# Altium schematic sheet Driver_SCR.SchDoc
size 93 x 63 mm; PageSetup: Record=PageOptions|CenterHorizontal=True|CenterVertical=True|PrintScale=0.71|XCorrection=1.00|YCorrection=1.00|PrintKind=1|BorderSize=5000000|LeftOffset=0|BottomOffset=0|Orientation=2|PaperLength=1000|PaperWidth=1000|Scale=100|PaperSource=15|PrintQuality=4000|MediaType=1|DitherType=10|PrintScaleMode=1|PaperKind=A4|PaperIndex=9
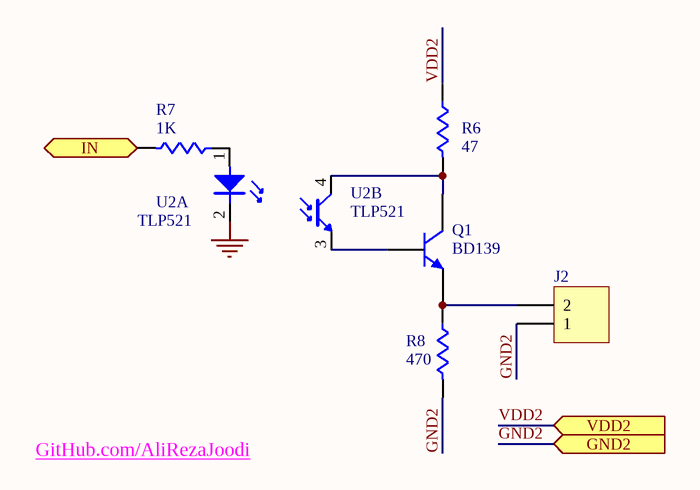
[diagram p0: Driver_SCR.SchDoc]

## Parts
J2  J2  [Fonics_2PIN_1]  (value not drawn)
Q1  Q1  value BD139  [SOT-32]
R6  value 47  [AXIAL-0.4]  (hidden comment: R6)
R7  value 1K  [AXIAL-0.4]  (hidden comment: R7)
R8  value 470  [AXIAL-0.4]  (hidden comment: R8)
U2  value TLP521  [DIP-4]  (hidden comment: U2)  (parts A,B of 2)

## Ports
GND2 (in), IN (in), VDD2 (in)

## Nets
GND: U2.2(K)
GND2: J2.1 R8.2 ; port GND2
IN: R7.2 ; port IN
VDD2: R6.1 ; port VDD2
NetJ2_2: J2.2 Q1.E R8.1
NetQ1_B: Q1.B U2.3(E)
NetQ1_C: Q1.C R6.2 U2.4(C)
NetR7_1: R7.1 U2.1(A)

## Notes on the sheet
- GitHub.com/AliRezaJoodi

## Library data of the parts
J2 = Header 2: Header, 2-Pin; LatestRevisionDate: 17-Jul-2002; LatestRevisionNote: Re-released for DXP Platform.; Publisher: Altium Limited
Q1 = BD139: NPN Transistor; E-mail: picpars@gmail.com; De: Seyed Mohsen Ghasemian; web: www.picpars.com
R6-R8 = Res1: Resistor; Manufacturer: Generic Components; Class I: Passive; Published: 8-Jun-2000; Revision: July-2002: Re-released for DXP Platform.; Publisher: Altium Limited; Class II: Resistor
U2 = Optoisolator: Publisher: Altium Limited